# Altium schematic sheet Wireless.SchDoc
size A4; SheetNumber: 5; SheetTotal: 7
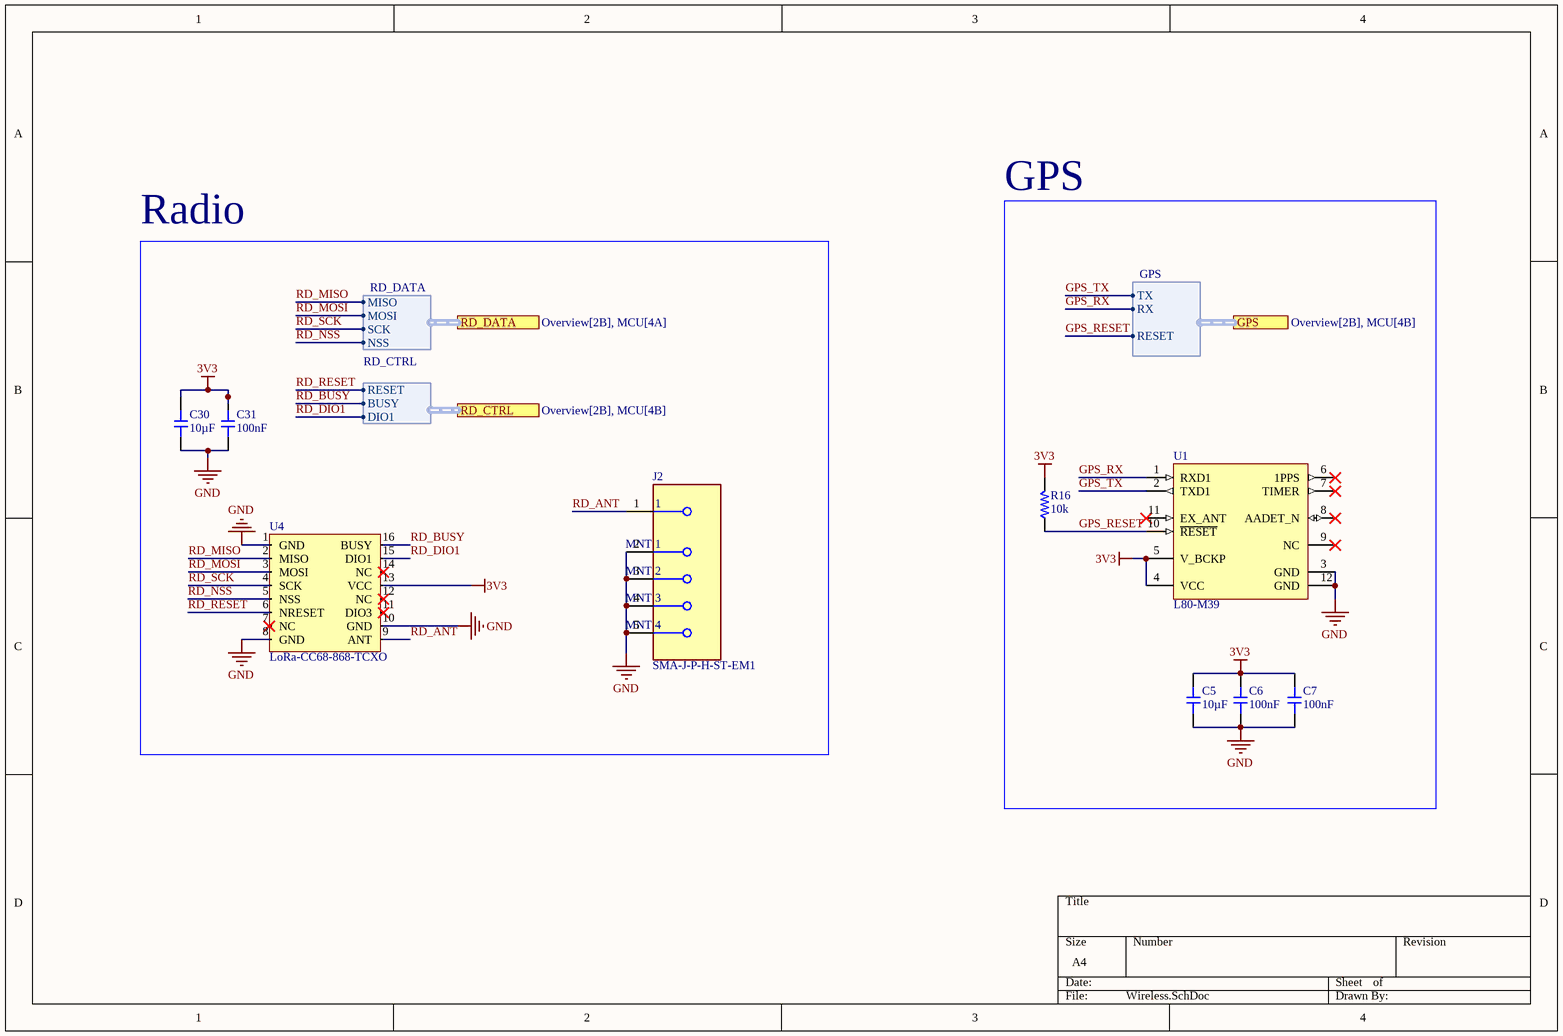
[diagram p0: Wireless.SchDoc]

## Parts
C5  value 10µF  [CAP-0402]  (hidden comment: CL05A106MQ5NUNC)
C6  value 100nF  [CAP-0402]  (hidden comment: CL05B104KO5NNNC)
C7  value 100nF  [CAP-0402]  (hidden comment: CL05B104KO5NNNC)
C30  value 10µF  [CAP-0402]  (hidden comment: CL05A106MQ5NUNC)
C31  value 100nF  [CAP-0402]  (hidden comment: CL05B104KO5NNNC)
J2  SMA-J-P-H-ST-EM1  [FP-SMA-J-P-H-ST-EM1-MFG]
R16  value 10k  [RES-0402]  (hidden comment: 0402WGF1002TCE)
U1  L80-M39  [QUEC-L80-M39-12_V]
U4  LoRa-CC68-868-TCXO  [LoRa-CC68-868-TCXO-Footprint-1]

## Blocks framed on the sheet
Radio: C30 C31 J2 U4
GPS: C5-C7 R16 U1

## Ports
GPS (harness GPS, see Overview[2B], MCU[4B]), RD_CTRL (harness RD_CTRL, see Overview[2B], MCU[4B]), RD_DATA (harness RD_DATA, see Overview[2B], MCU[4A])

## Harnesses
GPS: TX, RX, RESET
RD_DATA: MISO, MOSI, SCK, NSS
RD_CTRL: RESET, BUSY, DIO1

## Nets
3V3: C5.2 C6.2 C7.2 C30.2 C31.2 R16.2 U1.4(VCC) U1.5(V_BCKP) U4.13(VCC)
GND: C5.1 C6.1 C7.1 C30.1 C31.1 J2.2(MNT_1) J2.3(MNT_2) J2.4(MNT_3) J2.5(MNT_4) U1.3(GND) U1.12(GND) U4.1(GND) U4.8(GND) U4.10(GND)
GPS_RESET: R16.1 U1.10(~{RESET}) ; port GPS.RESET
GPS_RX: U1.1(RXD1) ; port GPS.RX
GPS_TX: U1.2(TXD1) ; port GPS.TX
RD_ANT: J2.1 U4.9(ANT)
RD_BUSY: U4.16(BUSY) ; port RD_CTRL.BUSY
RD_DIO1: U4.15(DIO1) ; port RD_CTRL.DIO1
RD_MISO: U4.2(MISO) ; port RD_DATA.MISO
RD_MOSI: U4.3(MOSI) ; port RD_DATA.MOSI
RD_NSS: U4.5(NSS) ; port RD_DATA.NSS
RD_RESET: U4.6(NRESET) ; port RD_CTRL.RESET
RD_SCK: U4.4(SCK) ; port RD_DATA.SCK

Not connected (* = marked no-connect by the designer): U1 6(1PPS)* 7(TIMER)* 8(AADET_N)* 9(NC)* 11(EX_ANT)*; U4 7(NC)* 11(DIO3)* 12(NC)* 14(NC)*

## Library data of the parts
C5 C30 = CMP-001-00136-1: Capacitor, Ceramic (MLCC), 10uF, ±20%, 6.3V, X5R, ±20%, SMD 0402; Manufacturer: Samsung Electro-Mechanics; Temperature Coefficient: X5R; ComponentLink2URL: https://jlcpcb.com/partdetail/C15525; Voltage Rating: 6.3V; ComponentLink2Description: JLCPCB Part URL; Source: jlcpcb_capacitors_basic.schlib; Category: Capacitors - MLCC; RoHS: Yes; ComponentLink1Description: Datasheet; ComponentLink1URL: https://datasheet.lcsc.com/lcsc/2208231630_Samsung-Electro-Mechanics-CL05A106MQ5NUNC_C15525.pdf; Design Item ID: CL05A106MQ5NUNC; JLCPCB Part Number: C15525; JLCPCB Basic Part: Yes; Case/Package: 0402; ComponentLink3Description: LCSC Part URL; ComponentLink3URL: https://lcsc.com/product-detail/Multilayer-Ceramic-Capacitors-MLCC---SMD-SMT_Samsung-Electro-Mechanics-Samsung-Electro-Mechanics-CL05A106MQ5NUNC_C15525.html; Tolerance: 20%; Manufacturer Part Number: CL05A106MQ5NUNC
C6 C7 C31 = CMP-001-00142-1: Capacitor, Ceramic (MLCC), 100nF, ±10%, 16V, X7R, ±10%, SMD 0402; Manufacturer: Samsung Electro-Mechanics; Design Item ID: CL05B104KO5NNNC; Source: jlcpcb_capacitors_basic.schlib; ComponentLink2URL: https://jlcpcb.com/partdetail/C1525; Voltage Rating: 16V; Tolerance: 10%; Temperature Coefficient: X7R; ComponentLink2Description: JLCPCB Part URL; ComponentLink1URL: https://datasheet.lcsc.com/lcsc/1810191219_Samsung-Electro-Mechanics-CL05B104KO5NNNC_C1525.pdf; JLCPCB Basic Part: Yes; JLCPCB Part Number: C1525; ComponentLink3URL: https://lcsc.com/product-detail/Multilayer-Ceramic-Capacitors-MLCC---SMD-SMT_Samsung-Electro-Mechanics-Samsung-Electro-Mechanics-CL05B104KO5NNNC_C1525.html; Manufacturer Part Number: CL05B104KO5NNNC; ComponentLink1Description: Datasheet; Case/Package: 0402; RoHS: Yes; Category: Capacitors - MLCC; ComponentLink3Description: LCSC Part URL
J2 = CMP-002-00096-1: RF SMA Connector, 1 Contact(s), Female, Board Mount, Surface Mount Terminal, Locking, Jack; Max Operating Temperature: 125°C; RoHS Compliant: Yes; Mounting Technology: Board; Min Operating Temperature: -65°C; Connector Type: SMA
R16 = CMP-009-00191-1: Resistor, 10kΩ, ±1%, 62.5mW, 50V, ±100ppm/℃, -55℃~+155℃, SMD 0402; Manufacturer: Uniroyal; Temperature Rating: -55℃~+155℃; ComponentLink1URL: https://datasheet.lcsc.com/lcsc/2206010100_UNI-ROYAL-Uniroyal-Elec-0402WGF1002TCE_C25744.pdf; Source: jlcpcb_resistors_basic.schlib; Tolerance: 1%; Design Item ID: 0402WGF1002TCE; ComponentLink1Description: Datasheet; ComponentLink2URL: https://jlcpcb.com/partdetail/C25744; Category: Resistors; JLCPCB Part Number: C25744; ComponentLink2Description: JLCPCB Part URL; Temperature Coefficient: ±100ppm/℃; JLCPCB Basic Part: Yes; Power Rating: 62.5mW; Case/Package: 0402; Voltage Rating: 50V; Manufacturer Part Number: 0402WGF1002TCE
U1 = CMP-021-00008-3: GPS Module 15, 0x15, 0x4, 0mm SMD w/Antenna 3, 0V
U4 = CMP-00025-00003-3: LoRa-CC68 targeting 868MHz and with a TXCO